# EAGLE design Pico radio (EAGLE 9.6.2)
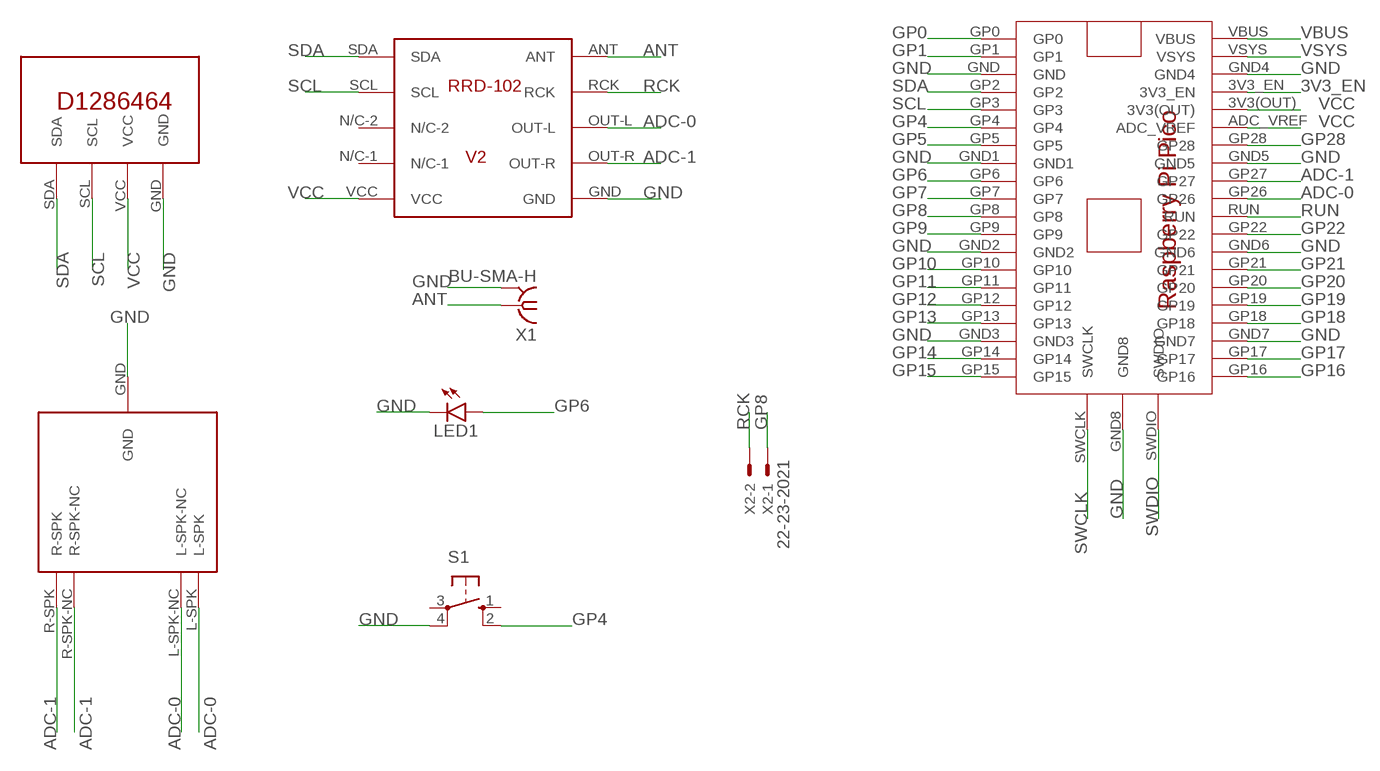
[diagram p0: schematic, sheet 1]

## Parts
LED1  LED3MM  [LED3MM]
S1  10-XX  [B3F-10XX]
U$1  OLED_DISPLAY  [OLED_DISPLAY]
U$2  RASPBERRYPIPICO  [RASPBERRYPIPICO]
U$3  RDD-V2  [RDD-V2]
U$4  AUDIO_JACK  [AUDIO_JACK]
X1  BU-SMA-H  [BU-SMA-H]
X2  22-23-2021  [22-23-2021]

## Nets
3V3_EN: U$2.3V3_EN
ADC-0: U$2.GP26 U$3.OUT-L U$4.L-SPK U$4.L-SPK-NC
ADC-1: U$2.GP27 U$3.OUT-R U$4.R-SPK U$4.R-SPK-NC
ANT: U$3.ANT X1.1
GND: LED1.K(C) S1.4(P1) U$1.GND U$2.GND U$2.GND1 U$2.GND2 U$2.GND3 U$2.GND4 U$2.GND5 U$2.GND6 U$2.GND7 U$2.GND8 U$3.GND U$4.GND X1.2 X1.3 X1.4 X1.5
GP0: U$2.GP0
GP1: U$2.GP1
GP4: S1.2(S1) U$2.GP4
GP5: U$2.GP5
GP6: LED1.A U$2.GP6
GP7: U$2.GP7
GP8: U$2.GP8 X2.1
GP9: U$2.GP9
GP10: U$2.GP10
GP11: U$2.GP11
GP12: U$2.GP12
GP13: U$2.GP13
GP14: U$2.GP14
GP15: U$2.GP15
GP16: U$2.GP16
GP17: U$2.GP17
GP18: U$2.GP18
GP19: U$2.GP19
GP20: U$2.GP20
GP21: U$2.GP21
GP22: U$2.GP22
GP28: U$2.GP28
RCK: U$3.RCK X2.2
RUN: U$2.RUN
SCL: U$1.SCL U$2.GP3 U$3.SCL
SDA: U$1.SDA U$2.GP2 U$3.SDA
SWCLK: U$2.SWCLK
SWDIO: U$2.SWDIO
VBUS: U$2.VBUS
VCC: U$1.VCC U$2.3V3(OUT) U$2.ADC_VREF U$3.VCC
VSYS: U$2.VSYS
Unconnected: S1.1(S) S1.3(P) U$3.N/C-1 U$3.N/C-2

## Library data of the parts
LED1 = led:LED: LED OSRAM: - CHIPLED LG R971, LG N971, LY N971, LG Q971, LY Q971, LO R971, LY R971 LH N974, LH R974 LS Q976, LO Q976, LY Q976 LO Q996 - Hyper CHIPLED LW Q18S LB Q993, LB Q99A, LB R99A - SideLED LS A670, LO A670, LY A670, LG A670, LP A670 LB A673, LV A673, LT A673, LW A673 LH A674 LY A675 LS A676, LA A676, LO A676, LY A676, LW A676 LS A679, LY A679, LG A679 - Hyper Micro SIDELED® LS Y876, LA Y876, LO Y876, LY Y876 LT Y87S - SmartLED LW L88C, LW L88S LB L89C, LB L89S, LG L890 LS L89K, LO L89K, LY L89K LS L896, LA L896, LO L896, LY L896 - TOPLED LS T670, LO T670, LY T670, LG T670, LP T670 LSG T670, LSP T670, LSY T670, LOP T670, LYG T670 LG T671, LOG T671, LSG T671 LB T673, LV T673, LT T673, LW T673 LH T674 LS T676, LA T676, LO T676, LY T676, LB T676, LH T676, LSB T676, LW T676 LB T67C, LV T67C, LT T67C, LS T67K, LO T67K, LY T67K, LW E67C LS E67B, LA E67B, LO E67B, LY E67B, LB E67C, LV E67C, LT E67C LW T67C LS T679, LY T679, LG T679 LS T770, LO T770, LY T770, LG T770, LP T770 LB T773, LV T773, LT T773, LW T773 LH T774 LS E675, LA E675, LY E675, LS T675 LS T776, LA T776, LO T776, LY T776, LB T776 LHGB T686 LT T68C, LB T68C - Hyper Mini TOPLED® LB M676 - Mini TOPLED Santana® LG M470 LS M47K, LO M47K, LY M47K Source: http://www.osram.convergy.de LUXEON: - LUMILED® LXK2-PW12-R00, LXK2-PW12-S00, LXK2-PW14-U00, LXK2-PW14-V00 LXK2-PM12-R00, LXK2-PM12-S00, LXK2-PM14-U00 LXK2-PE12-Q00, LXK2-PE12-R00, LXK2-PE12-S00, LXK2-PE14-T00, LXK2-PE14-U00 LXK2-PB12-K00, LXK2-PB12-L00, LXK2-PB12-M00, LXK2-PB14-N00, LXK2-PB14-P00, LXK2-PB14-Q00 LXK2-PR12-L00, LXK2-PR12-M00, LXK2-PR14-Q00, LXK2-PR14-R00 LXK2-PD12-Q00, LXK2-PD12-R00, LXK2-PD12-S00 LXK2-PH12-R00, LXK2-PH12-S00 LXK2-PL12-P00, LXK2-PL12-Q00, LXK2-PL12-R00 Source: www.luxeon.com KINGBRIGHT: KA-3528ASYC Source: www.kingbright.com
S1 = switch-omron:10-XX: OMRON SWITCH; MPN: B3F-1000; OC_FARNELL: 176432; OC_NEWARK: 36M3542
U$1 = oled_display:OLED_DISPLAY
U$2 = raspberrypi_pico:RASPBERRYPIPICO
U$3 = RDD-V2:RDD-V2
U$4 = Audio Jack:AUDIO_JACK
X1 = con-coax:BU-SMA-H: FEMALE SMA CONNECTOR Radiall; OC_FARNELL: unknown; OC_NEWARK: unknown
X2 = con-molex:22-23-2021: .100" (2.54mm) Center Header - 2 Pin; MF: MOLEX; MPN: 22-23-2021; OC_FARNELL: 1462926; OC_NEWARK: 25C3832

## Net classes
0 default: width 0.305 mm, drill 0.305 mm, clearance 0.305 mm

## Board
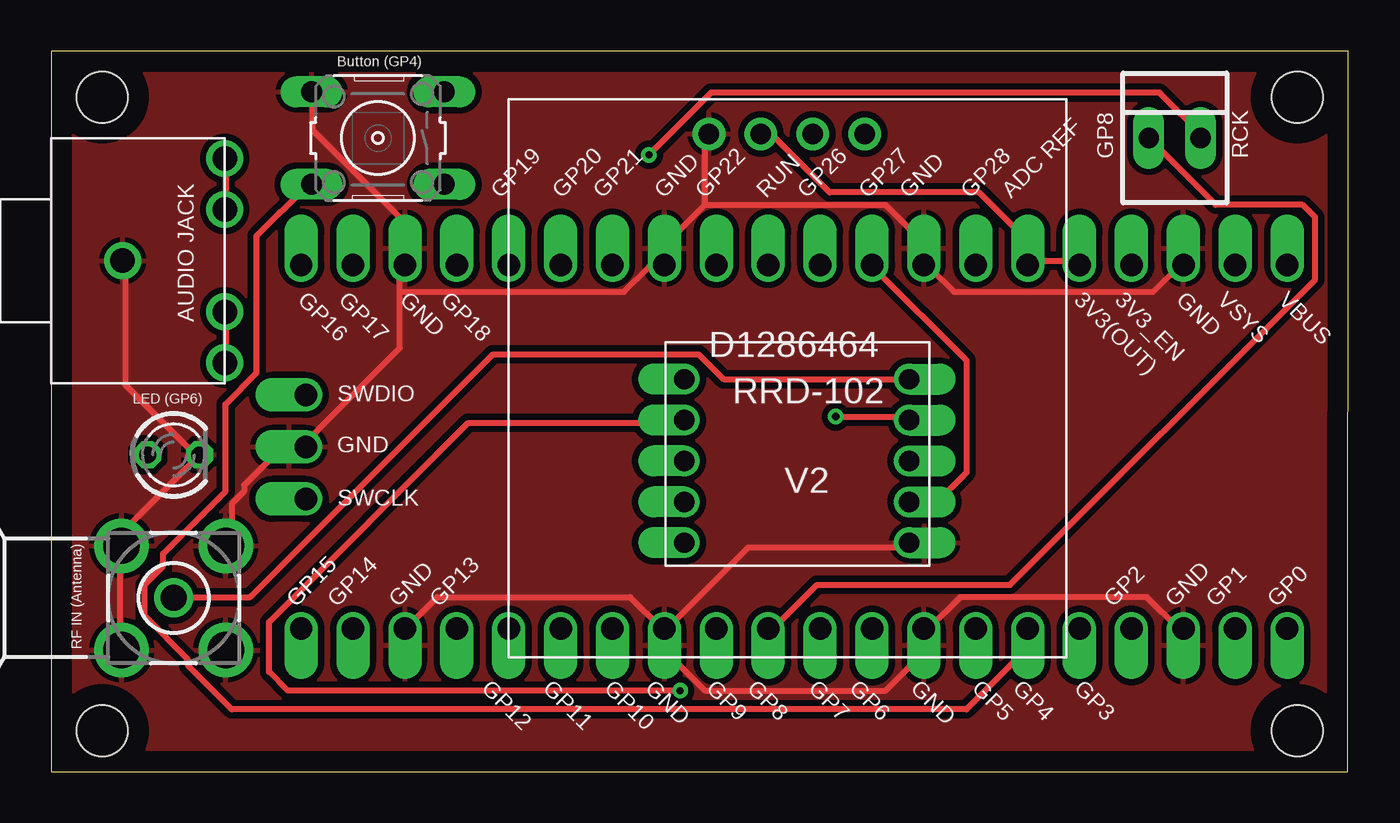
[diagram p1: board, top side]
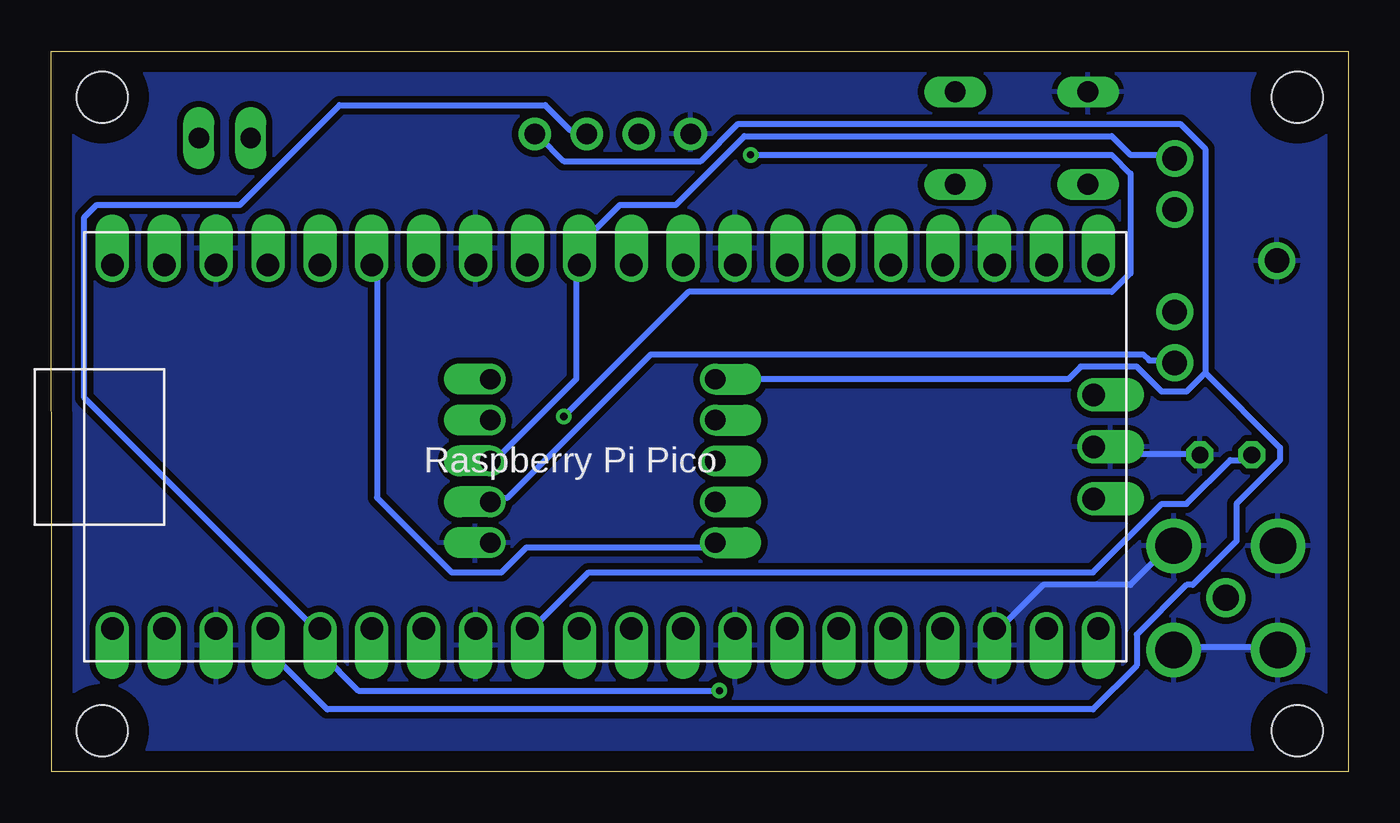
[diagram p2: board, bottom side, seen from below]

Size 63.5 x 35.26 mm. Coordinates in mm from the lower left corner, seen from the top.
Outline: 0,0 63.48,0 63.5,35.26 0,35.26 0,0
Copper layers (1*16): Top 0.035mm / dielectric 1.5mm / Bottom 0.035mm
Design rules "default *": minimum track width 12mil, minimum drill 0.35mm, track to track 12mil, track to pad 12mil, pad to pad 12mil, via to via 12mil, smd to smd 6mil, copper to edge 40mil, drill to drill 6mil, minimum pad ring 10mil, minimum via ring 8mil, stop-mask expansion 4mil, vias tented up to drill 0mil, thermal gap 10mil
Holes 2.5 mm at 2.5,33 2.5,2 61,2 61,33

### Footprints (pad centres in the part's own frame; a part is rotated, then mirrored left to right if it is on the bottom)
LED3MM = drill 0.813 octagon: A -1.27,0; K 1.27,0
B3F-10XX = drill 1.016 long: 1 -3.251,2.261; 2 3.251,2.261; 3 -3.251,-2.261; 4 3.251,-2.261
OLED_DISPLAY = drill 1.001 pad 1.6: GND -3.8,12.2; SCL 1.28,12.2; SDA 3.82,12.2; VCC -1.26,12.2
RASPBERRYPIPICO = drill 1.1 pad 1.6 offset: 3V3(OUT) 10.16,17.78; 3V3_EN 7.62,17.78; ADC_VREF 12.7,17.78; GND 5.08,0; GND1 17.78,0; GND2 30.48,0; GND3 43.18,0; GND4 5.08,17.78; GND5 17.78,17.78; GND6 30.48,17.78; GND7 43.18,17.78; GND8 48.03,8.89; GP0 0,0; GP1 2.54,0; GP2 7.62,0; GP3 10.16,0; GP4 12.7,0; GP5 15.24,0; GP6 20.32,0; GP7 22.86,0; GP8 25.4,0; GP9 27.94,0; GP10 33.02,0; GP11 35.56,0; GP12 38.1,0; GP13 40.64,0; GP14 45.72,0; GP15 48.26,0; GP16 48.26,17.78; GP17 45.72,17.78; GP18 40.64,17.78; GP19 38.1,17.78; GP20 35.56,17.78; GP21 33.02,17.78; GP22 27.94,17.78; GP26 22.86,17.78; GP27 20.32,17.78; GP28 15.24,17.78; RUN 25.4,17.78; SWCLK 48.03,6.35; SWDIO 48.03,11.43; VBUS 0,17.78; VSYS 2.54,17.78
RDD-V2 = drill 1 offset: ANT 12,9.2; GND 12,1.2; N/C-1 1,3.2; N/C-2 1,5.2; OUT-L 12,5.2; OUT-R 12,3.2; RCK 12,7.2; SCL 1,7.2; SDA 1,9.2; VCC 1,1.2
AUDIO_JACK = drill 1.2: GND 6,5; L-SPK 11,0; L-SPK-NC 8.5,0; R-SPK 1,0; R-SPK-NC 3.5,0
BU-SMA-H = drill 1.27: 1 0,0 | drill 1.778: 2 -2.55,2.55; 3 2.55,2.55; 4 2.55,-2.55; 5 -2.55,-2.55
22-23-2021 = drill 1 long: 1 -1.27,0; 2 1.27,0

### Placement (x,y rotation side)
LED1  6,15.5 0 top
S1  16,31 180 top
U$1  36,19 0 top
U$2  60.5,7 0 bottom
U$3  30,10 0 top
U$4  8.5,19 90 top
X1  6,8.5 180 top
X2  55,31 0 top

### Tracks (layer width: path | path; a pad name or v marks a point on that pad's centre or on a via)
ADC-0
  Top 0.305: U$4.L-SPK-NC 8.53,27.74 8.53,29.87 U$4.L-SPK
  Bottom 0.305: U$3.OUT-L 41.76,15.24 37.8,19.2 37.8,24.69 U$2.GP26 37.49,24.99 37.49,25.91 35.66,27.74 32.92,27.74 29.57,31.09 11.58,31.09 10.67,30.18 8.53,30.18 U$4.L-SPK
ADC-1
  Top 0.305: U$4.R-SPK 8.53,20.12 8.53,22.25 U$4.R-SPK-NC | U$3.OUT-R 42.06,13.41 43.59,13.41 44.81,14.63 44.81,20.12 40.23,24.69 U$2.GP27
  Bottom 0.305: U$4.R-SPK 8.53,20.12 9.75,20.12 10.06,20.42 34.14,20.42 41.15,13.41 41.76,13.41 U$3.OUT-R
ANT
  Top 0.305: U$3.ANT 41.76,19.2 32.92,19.2 31.7,20.42 21.64,20.42 9.75,8.53 6.1,8.53 X1.1
GND
  Top 0.305: 32,27.74 32,31.09 U$1.GND | 32,27.74 30.18,25.91 30.18,24.99 U$2.GND6 29.87,24.69 29.26,24.69 28.04,23.47 17.07,23.47 | 32,27.74 40.84,27.74 42.67,25.91 42.67,24.99 U$2.GND5 42.98,24.69 44.2,23.47 53.95,23.47 55.17,24.69 U$2.GND4 | U$2.GND 55.17,7.01 53.65,8.53 44.5,8.53 42.98,7.01 U$2.GND1 42.67,6.71 42.67,5.79 40.84,3.96 32,3.96 30.18,5.79 30.18,6.71 U$2.GND2 | U$3.GND 41.76,10.97 34.14,10.97 30.18,7.01 U$2.GND2 | X1.3 3.35,6.1 3.35,10.97 X1.4 3.66,11.28 3.66,11.89 7.01,15.24 LED1.K 7.01,15.54 3.66,18.9 3.66,24.99 U$4.GND | S1.4 12.8,33.22 12.8,31.39 17.07,27.13 17.07,24.99 U$2.GND7 17.07,24.69 17.07,23.47 | 17.07,23.47 17.07,20.73 12.5,16.15 U$2.GND8 12.19,15.85 11.28,15.85 9.45,14.02 9.45,13.72 8.84,13.11 8.84,11.28 X1.5 | U$2.GND2 29.87,7.01 28.35,8.53 18.9,8.53 17.37,7.01 U$2.GND3
  Bottom 0.305: X1.2 8.53,6.1 3.66,6.1 X1.3 | U$2.GND3 17.07,7.01 14.94,9.14 10.67,9.14 8.84,10.97 X1.5 | LED1.K 7.32,15.54 11.89,15.54 12.19,15.85 U$2.GND8
  pour Top: 0,35 64,35 64,0 0,0
  pour Bottom: 0,35 64,35 64,0 0,0
GP4
  Top 0.305: S1.2 12.5,28.65 10.06,26.21 10.06,19.51 8.53,17.98 8.53,13.72 5.49,10.67 5.49,10.06 4.57,9.14 4.57,7.62 6.71,5.49 6.71,5.18 8.84,3.05 44.81,3.05 47.55,5.79 47.55,6.71 U$2.GP4
GP6
  Bottom 0.305: LED1.A 4.88,15.24 5.79,15.24 7.92,13.11 9.14,13.11 12.5,9.75 37.19,9.75 39.93,7.01 U$2.GP6
GP8
  Top 0.305: X2.1 53.95,30.79 57,27.74 61.27,27.74 61.87,27.13 61.87,24.08 46.94,9.14 37.49,9.14 35.36,7.01 U$2.GP8
RCK  (via drill 0.35)
  Top 0.305: v38.41,17.37 41.76,17.37 U$3.RCK | v29.26,30.18 32.31,33.22 54.25,33.22 56.39,31.09 X2.2
  Bottom 0.305: v38.41,17.37 32.31,23.47 11.58,23.47 10.67,24.38 10.67,29.26 11.58,30.18 v29.26,30.18
SCL  (via drill 0.35)
  Top 0.305: v30.79,3.96 11.58,3.96 10.67,4.88 10.67,7.32 20.42,17.07 30.79,17.07 U$3.SCL
  Bottom 0.305: v30.79,3.96 48.46,3.96 50.29,5.79 50.29,6.71 U$2.GP3 50.6,7.01 61.87,18.29 61.87,27.13 61.27,27.74 54.25,27.74 49.38,32.61 39.32,32.61 38.1,31.39 37.49,31.39 U$1.SCL
SDA
  Bottom 0.305: 7.01,19.51 7.92,18.59 9.14,18.59 10.36,19.81 13.11,19.81 13.72,19.2 30.79,19.2 U$3.SDA | 7.01,19.51 7.01,30.48 8.23,31.7 29.87,31.7 31.7,29.87 38.41,29.87 39.62,31.09 U$1.SDA | 7.01,19.51 3.35,15.85 3.35,15.24 5.49,13.11 5.49,11.28 7.62,9.14 7.92,9.14 10.36,6.71 10.36,5.18 12.5,3.05 49.99,3.05 52.73,5.79 52.73,6.71 U$2.GP2
VCC
  Top 0.305: U$1.VCC 34.75,31.09 35.36,31.09 38.1,28.35 45.41,28.35 47.55,26.21 47.55,24.99 U$2.ADC_VREF 47.85,24.99 50.29,24.99 U$2.3V3(OUT)
  Bottom 0.305: U$3.VCC 31.09,10.97 40.23,10.97 41.45,9.75 43.89,9.75 47.55,13.41 47.55,24.69 U$2.ADC_VREF

### Text on the board
tNames: Button (GP4) | GP8 | RCK | GP19 | GP20 | GP21 | GND | GP22 | RUN | GP26 | GP27 | GND | GP28 | ADC REF | GP16 | GP17 | GND | GP18 | 3V3(OUT) | 3V3_EN | GND | VSYS | VBUS | AUDIO JACK | LED (GP6) | SWDIO | GND | SWCLK | GP15 | GP15 | GP14 | GND | GP13 | GP2 | GND | GP1 | GP0 | RF IN (Antenna) | GP12 | GP11 | GP10 | GND | GP9 | GP8 | GP7 | GP6 | GND | GP5 | GP4 | GP3